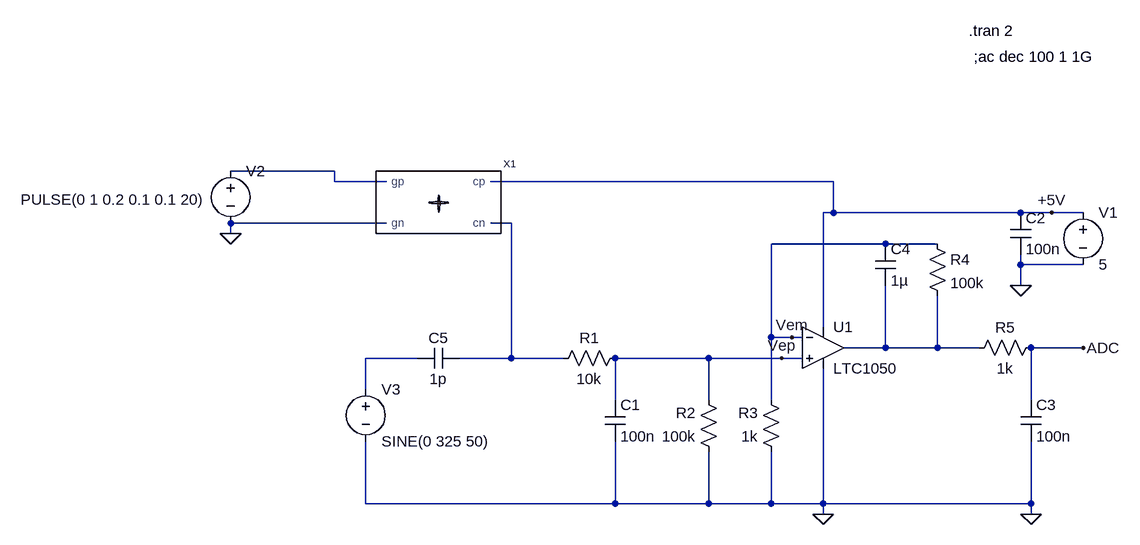
[diagram p0: schematic TP1Capteur.asc]
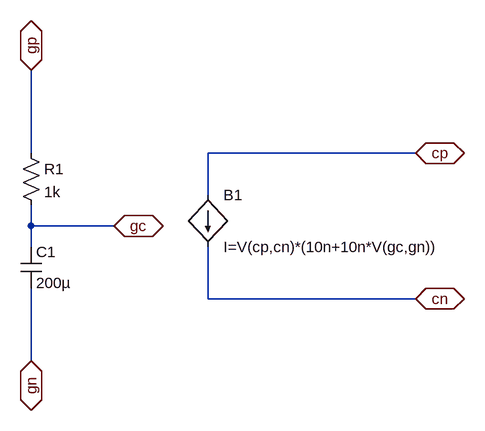
[diagram p1: sub-circuit modelcapteur.asc]
TP1Capteur.asc, the LTspice schematic file:
Version 4
SHEET 1 1136 680
WIRE -80 -144 -240 -144
WIRE -80 -128 -80 -144
WIRE 0 -128 -80 -128
WIRE 688 -128 160 -128
WIRE 688 -80 688 -128
WIRE 688 -80 672 -80
WIRE 976 -80 688 -80
WIRE 1024 -80 976 -80
WIRE 1072 -80 1024 -80
WIRE 0 -64 -240 -64
WIRE 192 -64 160 -64
WIRE -240 -48 -240 -64
WIRE 768 -32 592 -32
WIRE 848 -32 768 -32
WIRE 976 0 976 -16
WIRE 1072 0 976 0
WIRE 976 32 976 0
WIRE 672 96 672 -80
WIRE 592 112 592 -32
WIRE 624 112 592 112
WIRE 640 112 624 112
WIRE 768 128 768 32
WIRE 768 128 704 128
WIRE 848 128 848 48
WIRE 848 128 768 128
WIRE 912 128 848 128
WIRE 1072 128 992 128
WIRE 48 144 -32 144
WIRE 192 144 192 -64
WIRE 192 144 112 144
WIRE 272 144 192 144
WIRE 496 144 352 144
WIRE 608 144 496 144
WIRE 640 144 608 144
WIRE -32 192 -32 144
WIRE 352 208 352 144
WIRE 496 208 496 144
WIRE 592 208 592 112
WIRE 992 208 992 128
WIRE -32 368 -32 272
WIRE 352 368 352 272
WIRE 352 368 -32 368
WIRE 496 368 496 288
WIRE 496 368 352 368
WIRE 592 368 592 288
WIRE 592 368 496 368
WIRE 672 368 672 160
WIRE 672 368 592 368
WIRE 992 368 992 272
WIRE 992 368 672 368
WIRE 672 384 672 368
WIRE 992 384 992 368
FLAG 672 384 0
FLAG 976 32 0
FLAG 992 384 0
FLAG 1072 128 ADC
FLAG 624 112 Vem
FLAG 608 144 Vep
FLAG 1024 -80 +5V
FLAG -240 -48 0
SYMBOL res 368 128 R90
WINDOW 0 0 56 VBottom 2
WINDOW 3 32 56 VTop 2
SYMATTR InstName R1
SYMATTR Value 10k
SYMBOL res 512 304 R180
WINDOW 0 36 76 Left 2
WINDOW 3 36 40 Left 2
SYMATTR InstName R2
SYMATTR Value 100k
SYMBOL res 608 304 R180
WINDOW 0 36 76 Left 2
WINDOW 3 36 40 Left 2
SYMATTR InstName R3
SYMATTR Value 1k
SYMBOL res 832 -48 R0
SYMATTR InstName R4
SYMATTR Value 100k
SYMBOL res 1008 112 R90
WINDOW 0 0 56 VBottom 2
WINDOW 3 32 56 VTop 2
SYMATTR InstName R5
SYMATTR Value 1k
SYMBOL cap 336 208 R0
SYMATTR InstName C1
SYMATTR Value 100n
SYMBOL cap 960 -80 R0
SYMATTR InstName C2
SYMATTR Value 100n
SYMBOL cap 976 208 R0
SYMATTR InstName C3
SYMATTR Value 100n
SYMBOL cap 752 -32 R0
SYMATTR InstName C4
SYMATTR Value 1µ
SYMBOL OpAmps\\LTC1050 672 64 R0
SYMATTR InstName U1
SYMBOL voltage 1072 -96 R0
WINDOW 123 0 0 Left 0
WINDOW 39 0 0 Left 0
SYMATTR InstName V1
SYMATTR Value 5
SYMBOL Modelcapteur 80 -96 R0
SYMATTR InstName X1
SYMBOL cap 112 128 R90
WINDOW 0 0 32 VBottom 2
WINDOW 3 32 32 VTop 2
SYMATTR InstName C5
SYMATTR Value 1p
SYMBOL voltage -240 -160 R0
WINDOW 3 -323 60 Left 2
WINDOW 123 0 0 Left 0
WINDOW 39 0 0 Left 0
SYMATTR InstName V2
SYMATTR Value PULSE(0 1 0.2 0.1 0.1 20)
SYMBOL voltage -32 176 R0
WINDOW 123 0 0 Left 0
WINDOW 39 0 0 Left 0
SYMATTR InstName V3
SYMATTR Value SINE(0 325 50)
TEXT 896 -360 Left 2 !.tran 2
TEXT 904 -320 Left 2 !;ac dec 100 1 1G

modelcapteur.asc, the sub-circuit schematic file:
Version 4
SHEET 1 880 680
WIRE -112 48 -112 -80
WIRE 480 48 160 48
WIRE 160 112 160 48
WIRE -112 160 -112 128
WIRE 16 160 -112 160
WIRE -112 192 -112 160
WIRE 160 272 160 192
WIRE 480 272 160 272
WIRE -112 368 -112 256
FLAG 480 48 cp
IOPIN 480 48 BiDir
FLAG 480 272 cn
IOPIN 480 272 BiDir
FLAG -112 -80 gp
IOPIN -112 -80 BiDir
FLAG -112 368 gn
IOPIN -112 368 BiDir
FLAG 16 160 gc
IOPIN 16 160 BiDir
SYMBOL bi 160 112 R0
SYMATTR InstName B1
SYMATTR Value I=V(cp,cn)*(10n+10n*V(gc,gn))
SYMBOL res -128 32 R0
SYMATTR InstName R1
SYMATTR Value 1k
SYMBOL cap -128 192 R0
SYMATTR InstName C1
SYMATTR Value 200µ

The netlist it stands for:
* TP1Capteur.asc
R1 Vep N002 10k
R2 0 Vep 100k
R3 0 Vem 1k
R4 Vem N003 100k
R5 ADC N003 1k
C1 Vep 0 100n
C2 +5V 0 100n
C3 ADC 0 100n
C4 Vem N003 1µ
XU1 Vep Vem +5V 0 N003 LTC1050  ; pins In+ In- V+ V- OUT
V1 +5V 0 5
XX1 +5V N002 N001 0 modelcapteur
C5 N002 N004 1p
V2 N001 0 PULSE(0 1 0.2 0.1 0.1 20)
V3 N004 0 SINE(0 325 50)

* block symbol definitions
.subckt modelcapteur cp cn gp gn
B1 cp cn I=V(cp,cn)*(10n+10n*V(gc,gn))
R1 gp gc 1k
C1 gc gn 200µ
.ends modelcapteur

.tran 2
;ac dec 100 1 1G
.lib LTC.lib
.backanno
.end